# EAGLE design Feather Wing Grow Light (EAGLE 9.6.2)
COMPANY: ADAFRUIT INDUSTRIES; DRAWN: KTOWN; REV: B
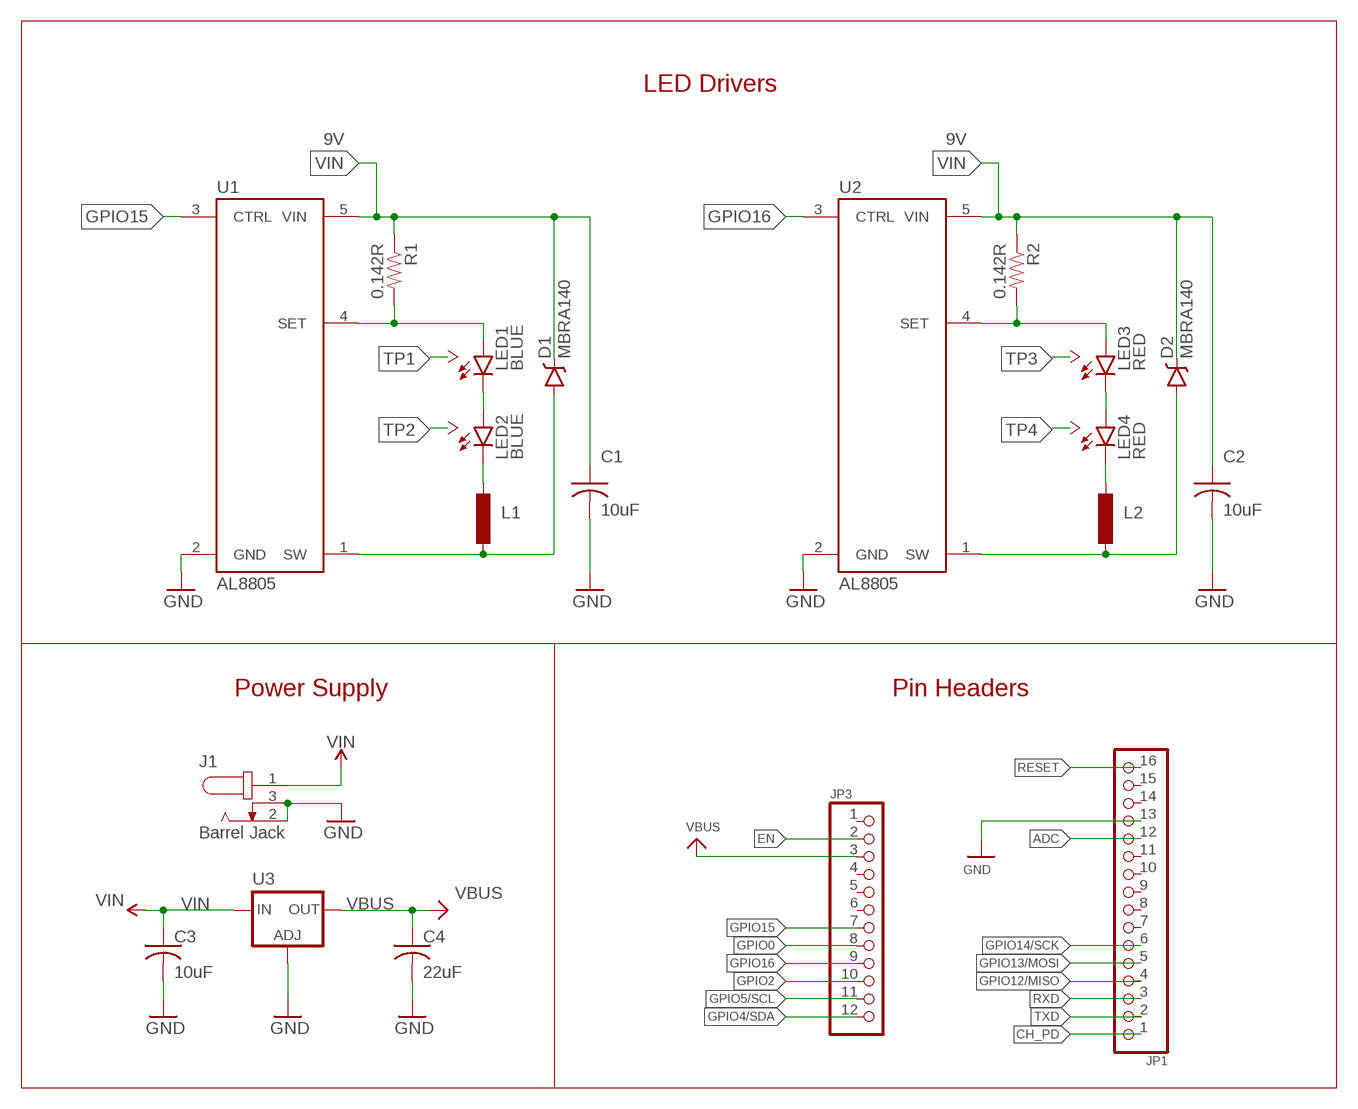
[diagram p0: schematic, sheet 1]

## Parts
C1  10uF  C-USC0805  [C0805]
C2  10uF  C-USC0805  [C0805]
C3  10uF  C-USC0805  [C0805]
C4  22uF  C-USC0805  [C0805]
D1  MBRA140  DIODE-SCHOTTKY-MBRA140  [SMA-DIODE]
D2  MBRA140  DIODE-SCHOTTKY-MBRA140  [SMA-DIODE]
J1  Barrel Jack  PJ-014D  [CUI_PJ-014D]
JP1  HEADER-1X16ROUND  [1X16_ROUND]
JP3  HEADER-1X12  [1X12_ROUND]
L1  33uH  L-EU0207/10  [0207/10]
L2  3.3µH/±30%/3.4A  L-EU0207/10  [0207/10]
LED1  BLUE  XPEWHT-01-0000-00BC2  [CREE_XLAMP]
LED2  BLUE  XPEWHT-01-0000-00BC2  [CREE_XLAMP]
LED3  RED  XPEWHT-01-0000-00BC2  [CREE_XLAMP]
LED4  RED  XPEWHT-01-0000-00BC2  [CREE_XLAMP]
R1  0.142R  0.3OHM-1/8W-1%(0805)  [0805]
R2  0.142R  0.3OHM-1/8W-1%(0805)  [0805]
U1  AL8805  [SOT23-5]
U2  AL8805  [SOT23-5]
U3  LM1117SOT223-REFLOW  [SOT223-R]

## Nets
ADC: JP1.12
CH_PD: JP1.1
EN: JP3.2
GND: C1.2 C2.2 C3.2 C4.2 J1.2 J1.3 JP1.13 U1.2(GND) U2.2(GND) U3.1(ADJ)
GPIO0: JP3.8
GPIO2: JP3.10
GPIO4/SDA: JP3.12
GPIO5/SCL: JP3.11
GPIO12/MISO: JP1.4
GPIO13/MOSI: JP1.5
GPIO14/SCK: JP1.6
GPIO15: JP3.7 U1.3(CTRL)
GPIO16: JP3.9 U2.3(CTRL)
N$1: LED3.C LED3.C@1(C) LED4.A LED4.A@1(A)
N$2: LED1.C LED1.C@1(C) LED2.A LED2.A@1(A)
N$3: L1.2 LED2.C LED2.C@1(C)
N$4: L2.2 LED4.C LED4.C@1(C)
OUT+1: LED3.A LED3.A@1(A) R2.2 U2.4(SET)
OUT+2: LED1.A LED1.A@1(A) R1.2 U1.4(SET)
RESET: JP1.16
RXD: JP1.3
SW1: D2.A L2.1 U2.1(SW)
SW2: D1.A L1.1 U1.1(SW)
TP1: LED1.X
TP2: LED2.X
TP3: LED3.X
TP4: LED4.X
TXD: JP1.2
VBUS [power]: C4.1 JP3.3 U3.2(OUT)
VIN: C1.1 C2.1 C3.1 D1.C D2.C J1.1 R1.1 R2.1 U1.5(VIN) U2.5(VIN) U3.3(IN)
Unconnected: JP1.7 JP1.8 JP1.9 JP1.10 JP1.11 JP1.14 JP1.15 JP3.1 JP3.4 JP3.5 JP3.6

## Notes on the sheet
- LED Drivers
- 9V | 9V
- Power Supply | Pin Headers

## Library data of the parts
C1-C4 = rcl:C-US: CAPACITOR, American symbol; SPICEPREFIX: C
D1 D2 = SparkFun-DiscreteSemi:DIODE-SCHOTTKY: Schottky diodes in SFE's production catalog BAT20J 1A 23V 0.62Vf RB751 120mA 40V 0.37Vf PMEG4005EJ 0.5A 40V 0.42Vf MBRA140 1A 40V 0.5Vf B340A 3A 40V SMA; PROD_ID: DIO-08053
J1 = PJ-014D:PJ-014D: 1.3 mm Center Pin, 2.5 A, Right Angle, Through Hole, Dc Power Jack Connector; MANUFACTURER: CUI INC; STANDARD: Manufacturer recommendations
JP1 = microbuilder:HEADER-1X16: PIN HEADER
JP3 = microbuilder:HEADER-1X12
L1 L2 = rcl:L-EU: INDUCTOR, European symbol; SPICEPREFIX: L
LED1-LED4 = GrowLight:XPEWHT-: Cree® XLamp® XP-E LEDs Source: www.cree.com/xlamp .. XLampXP-E.pdf
R1 R2 = SparkFun-Resistors:0.3OHM-1/8W-1%(0805): RES-11622; PROD_ID: RES-11622; VALUE: 0.3
U1 U2 = SparkFun-PowerIC:AL8805: Constant current LED driver PWM-able 1MHz switch freq 6V-36V Up to 1A LED current; PROD_ID: IC-11626; VALUE: AL8805WS
U3 = microbuilder:LM1117: LM1117 Voltage Regulator LM1117 Adjustable Voltage regulator [Digikey: LM1117IMP-ADJDKR-ND] LM1117 3.3V Voltage regulator [AP1117E33GDIDKR-ND] LM1117 5.0V Voltage regulator [AP1117E50GDIDKR-ND] SOT223-REFLOW - SOT223 package for solder paste/reflow ovens SOT223-WAVE - SOT223 package for hand-soldering (larger pads) Note: For the fixed-voltage regulators, simply set the ADJ pin to GND.

## Net classes
0 default: width 0.305 mm
1 power: width 0.61 mm
2 gnd: width 0.61 mm

## Board
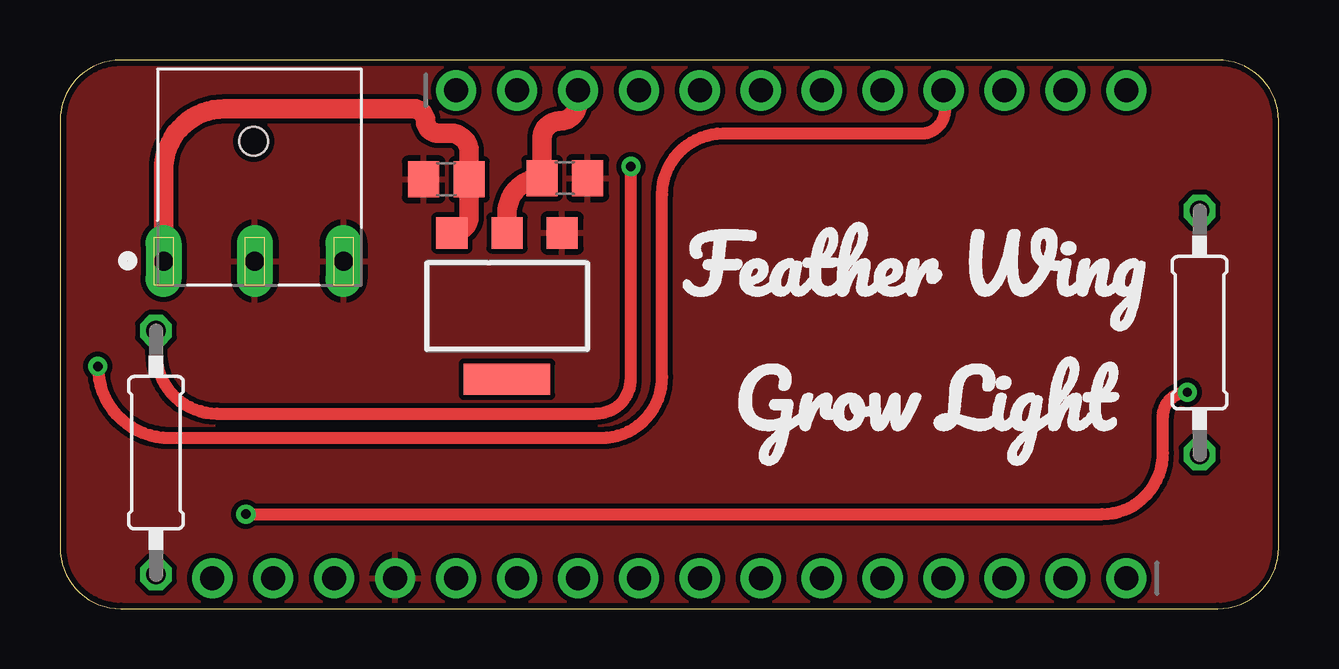
[diagram p1: board, top side]
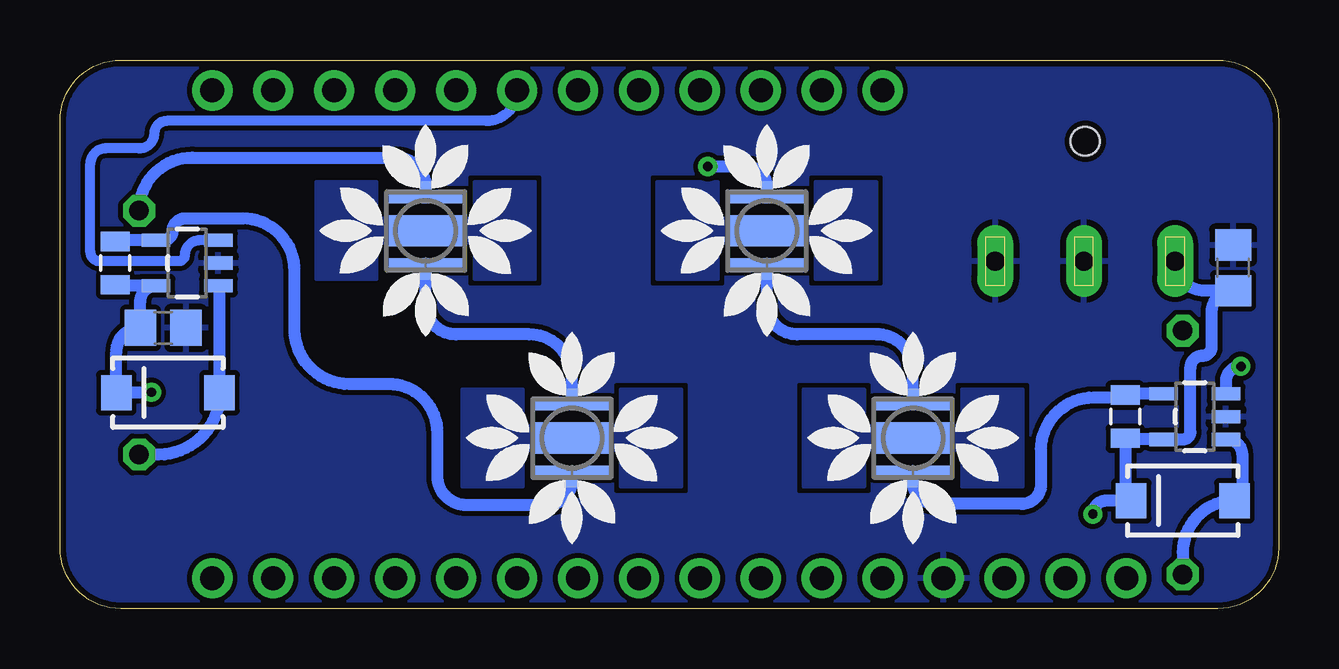
[diagram p2: board, bottom side, seen from below]

Size 50.8 x 22.86 mm. Coordinates in mm from the lower left corner, seen from the top.
Outline: 2.54,0 48.26,0 arc90 50.8,2.54 50.8,20.32 arc90 48.26,22.86 2.54,22.86 arc90 0,20.32 0,2.54 arc90 2.54,0
Copper layers (1*16): Top 0.035mm / dielectric 1.5mm / Bottom 0.035mm
Design rules "adafruit *": minimum track width 8mil, minimum drill 15.5mil, track to track 8mil, track to pad 8mil, pad to pad 8mil, via to via 8mil, smd to smd 8mil, copper to edge 10mil, drill to drill 8mil, minimum pad ring 10mil, minimum via ring 8mil, stop-mask expansion 2mil, vias tented up to drill 20mil, thermal gap 10mil

### Footprints (pad centres in the part's own frame; a part is rotated, then mirrored left to right if it is on the bottom)
C0805 = smd 1.3 x 1.5: 1 -0.95,0; 2 0.95,0
SMA-DIODE = smd 1.27 x 1.47: A -2.15,0; C 2.15,0
CUI_PJ-014D = drill 0.8 pad 1.5 long: 1 0,0; 2 0,7.5; 3 0,3.8 | hole 1.2: -5,3.75
1X16_ROUND = drill 1 pad 1.676: 1 -19.05,0; 2 -16.51,0; 3 -13.97,0; 4 -11.43,0; 5 -8.89,0; 6 -6.35,0; 7 -3.81,0; 8 -1.27,0; 9 1.27,0; 10 3.81,0; 11 6.35,0; 12 8.89,0; 13 11.43,0; 14 13.97,0; 15 16.51,0; 16 19.05,0
1X12_ROUND = drill 1 pad 1.676: 1 -13.97,0; 2 -11.43,0; 3 -8.89,0; 4 -6.35,0; 5 -3.81,0; 6 -1.27,0; 7 1.27,0; 8 3.81,0; 9 6.35,0; 10 8.89,0; 11 11.43,0; 12 13.97,0
0207/10 = drill 0.813 octagon: 1 -5.08,0; 2 5.08,0
CREE_XLAMP = smd 0.5 x 3.3: A -1.4,0; C 1.4,0 | smd 0.45 x 0.5: A@1 -1.825,0; C@1 1.825,0 | smd 1.3 x 3.3: X 0,0
0805 = smd 0.8 x 1.2: 1 -0.9,0; 2 0.9,0
SOT23-5 = smd 0.55 x 1.2: 1 -0.95,-1.3; 2 0,-1.3; 3 0.95,-1.3; 4 0.95,1.3; 5 -0.95,1.3
SOT223-R = smd 1.3 x 1.3: 1 -2.3,-3.05; 2 0,-3.05; 3 2.3,-3.05 | smd 3.6 x 1.3: 4 0,3.05

### Placement (x,y rotation side)
C1  1.9,14.2 90 bottom
C2  46.5,11.7 0 bottom
C3  16.11,17.89 180 top
C4  21.05,17.94 0 top
D1  46.3,9 180 bottom
D2  4,4.5 180 bottom
J1  4.32,14.48 270 top
JP1  25.4,1.27 180 top
JP3  30.48,21.59 0 top
L1  47.5,11.5 90 top
L2  4,6.5 90 top
LED1  29.46,7.11 90 bottom
LED2  35.56,15.75 90 bottom
LED3  15.24,7.11 90 bottom
LED4  21.34,15.75 90 bottom
R1  48.5,14.4 90 bottom
R2  6.4,8 90 bottom
U1  45.5,14.4 90 bottom
U2  3.5,8 90 bottom
U3  18.63,12.6 180 top

### Tracks (layer width: path | path; a pad name or v marks a point on that pad's centre or on a via)
GND
  pour Top (rank 2): 0,0 50.8,0 50.8,22.86 0,22.86
  pour Bottom (rank 2): 0,0 50.8,0 50.8,22.86 0,22.86
GPIO15
  Bottom 0.406: U1.3 44.98,15.35 arc-90 45.59,14.73 arc90 45.85,14.48 49.15,14.48 arc90 49.53,14.86 49.53,18.54 arc90 48.9,19.18 47.5,19.18 arc-90 46.86,19.81 arc90 46.35,20.32 33.02,20.32 arc-90 JP3.7
GPIO16  (via drill 0.39)
  Top 0.508: v1.58,10.1 arc90 4.56,7.11 22.56,7.11 arc90 25.1,9.65 25.1,17.26 arc-90 27.64,19.8 35.9,19.8 arc90 36.9,20.8 36.9,21.52 arc90 JP3.9
  Bottom 0.508: v1.58,10.1 arc-90 2.2,9.48 U2.3
N$1
  Bottom 0.508: LED4.A LED4.A@1 21.34,12.7 arc-90 20.07,11.43 16.76,11.43 arc90 15.24,9.91 LED3.C@1 LED3.C
N$2
  Bottom 0.508: LED1.C LED1.C@1 29.46,9.65 arc-90 31.24,11.43 34.29,11.43 arc90 35.56,12.7 LED2.A@1 LED2.A
N$3
  Bottom 0.508: L1.2 arc90 45.28,18.8 36.78,18.8 arc90 LED2.C@1 LED2.C
N$4  (via drill 0.39)
  Top 0.508: v23.8,18.41 arc90 v23.8,18.42 arc-90 v23.8,18.41 | L2.2 4,10.67 arc90 6.54,8.13 22.35,8.13 arc90 23.8,9.57 v23.8,18.41
  Bottom 0.508: LED4.C LED4.C@1 arc-90 22.18,18.42 v23.8,18.42
OUT+1
  Bottom 0.508: LED3.A LED3.A@1 arc-90 14.32,4.36 10.72,4.36 arc-90 9.91,5.18 9.91,6.6 arc90 7.71,8.8 6.5,8.8 arc-90 R2.2 arc90 6.35,8.95 U2.4
OUT+2
  Bottom 0.508: LED1.A@1 LED1.A 29.46,5.33 arc90 30.48,4.32 33.86,4.32 arc90 35.07,5.52 35.07,7.34 arc-90 37.09,9.36 38.73,9.36 arc90 41.02,11.64 41.02,14.1 arc-90 43.18,16.26 45.59,16.26 arc-90 46.1,15.75 arc90 46.5,15.35 U1.4 48.45,15.35 arc-90 R1.2
SW1
  Bottom 0.508: L2.1 4,2.35 arc90 D2.A arc-90 1.52,4.83 1.52,6.47 arc-90 U2.1
SW2
  Bottom 0.508: L1.1 46.69,6.42 arc-90 44.15,8.96 D1.A 44.15,13.4 arc-90 U1.1
TP1
  pour Bottom (no thermals): 31.5,7.62 31.5,9.14 34.04,9.14 34.04,5.08 31.5,5.08 31.5,6.6 27.43,6.6 27.43,5.08 24.89,5.08 24.89,9.14 27.43,9.14 27.43,8.13 27.43,7.62
TP2
  pour Bottom (no thermals): 37.59,16.26 37.59,17.78 40.13,17.78 40.13,13.72 37.59,13.72 37.59,15.24 33.53,15.24 33.53,13.72 30.99,13.72 30.99,17.78 33.53,17.78 33.53,16.76 33.53,16.26
TP3
  pour Bottom (no thermals): 17.27,7.62 17.27,9.14 19.81,9.14 19.81,5.08 17.27,5.08 17.27,6.6 13.21,6.6 13.21,5.08 10.67,5.08 10.67,9.14 13.21,9.14 13.21,7.62
TP4
  pour Bottom (no thermals): 23.37,16.26 23.37,17.78 25.91,17.78 25.91,13.72 23.37,13.72 23.37,15.24 19.3,15.24 19.3,13.72 16.76,13.72 16.76,17.78 19.3,17.78 19.3,16.76 19.3,16.26
  pour Bottom (no thermals): 23.37,16.26 23.37,17.78 25.91,17.78 25.91,13.72 23.37,13.72 23.37,15.24 19.3,15.24 19.3,13.72 16.76,13.72 16.76,17.78 19.3,17.78 19.3,16.76 19.3,16.26
VBUS
  Top 0.813: U3.2 18.63,16.48 arc-90 C4.1 20.09,19.59 arc-90 20.83,20.32 arc90 21.59,21.08 JP3.3
VIN  (via drill 0.39)
  Top 0.508: v7.75,3.94 43.43,3.94 arc90 45.97,6.48 45.97,8 arc-90 v46.99,9.02
  Top 0.813: U3.3 arc90 17.06,16.38 C3.1 17.06,19.01 arc90 16.26,19.81 15.75,19.81 arc-90 15.24,20.32 arc90 14.73,20.83 6.86,20.83 arc90 4.32,18.29 J1.1
  Bottom 0.508: R1.1 arc-90 48.45,13.45 U1.5 arc-90 47.45,12.8 C2.1 arc-90 48.45,10.7 D1.C 47.01,9 arc90 v46.99,9.02 | v7.75,3.94 arc90 7.18,4.5 D2.C arc90 6.4,4.75 R2.1 arc-90 6.35,7.05 U2.5 4,7.05 arc-90 3.68,7.37 3.68,10.03 arc90 3.17,10.54 arc-90 2.79,10.92 2.79,12.36 arc90 C1.1 3.09,13.25 arc90 J1.1